# Altium schematic sheet WC_Boot.SchDoc
size B; Organization: Altium Limited; Address1: L3, 12a Rodborough Rd; Address2: Frenchs Forest; Address3: NSW; Address4: Australia 2086; DocumentNumber: 8; SheetNumber: 8; SheetTotal: 11
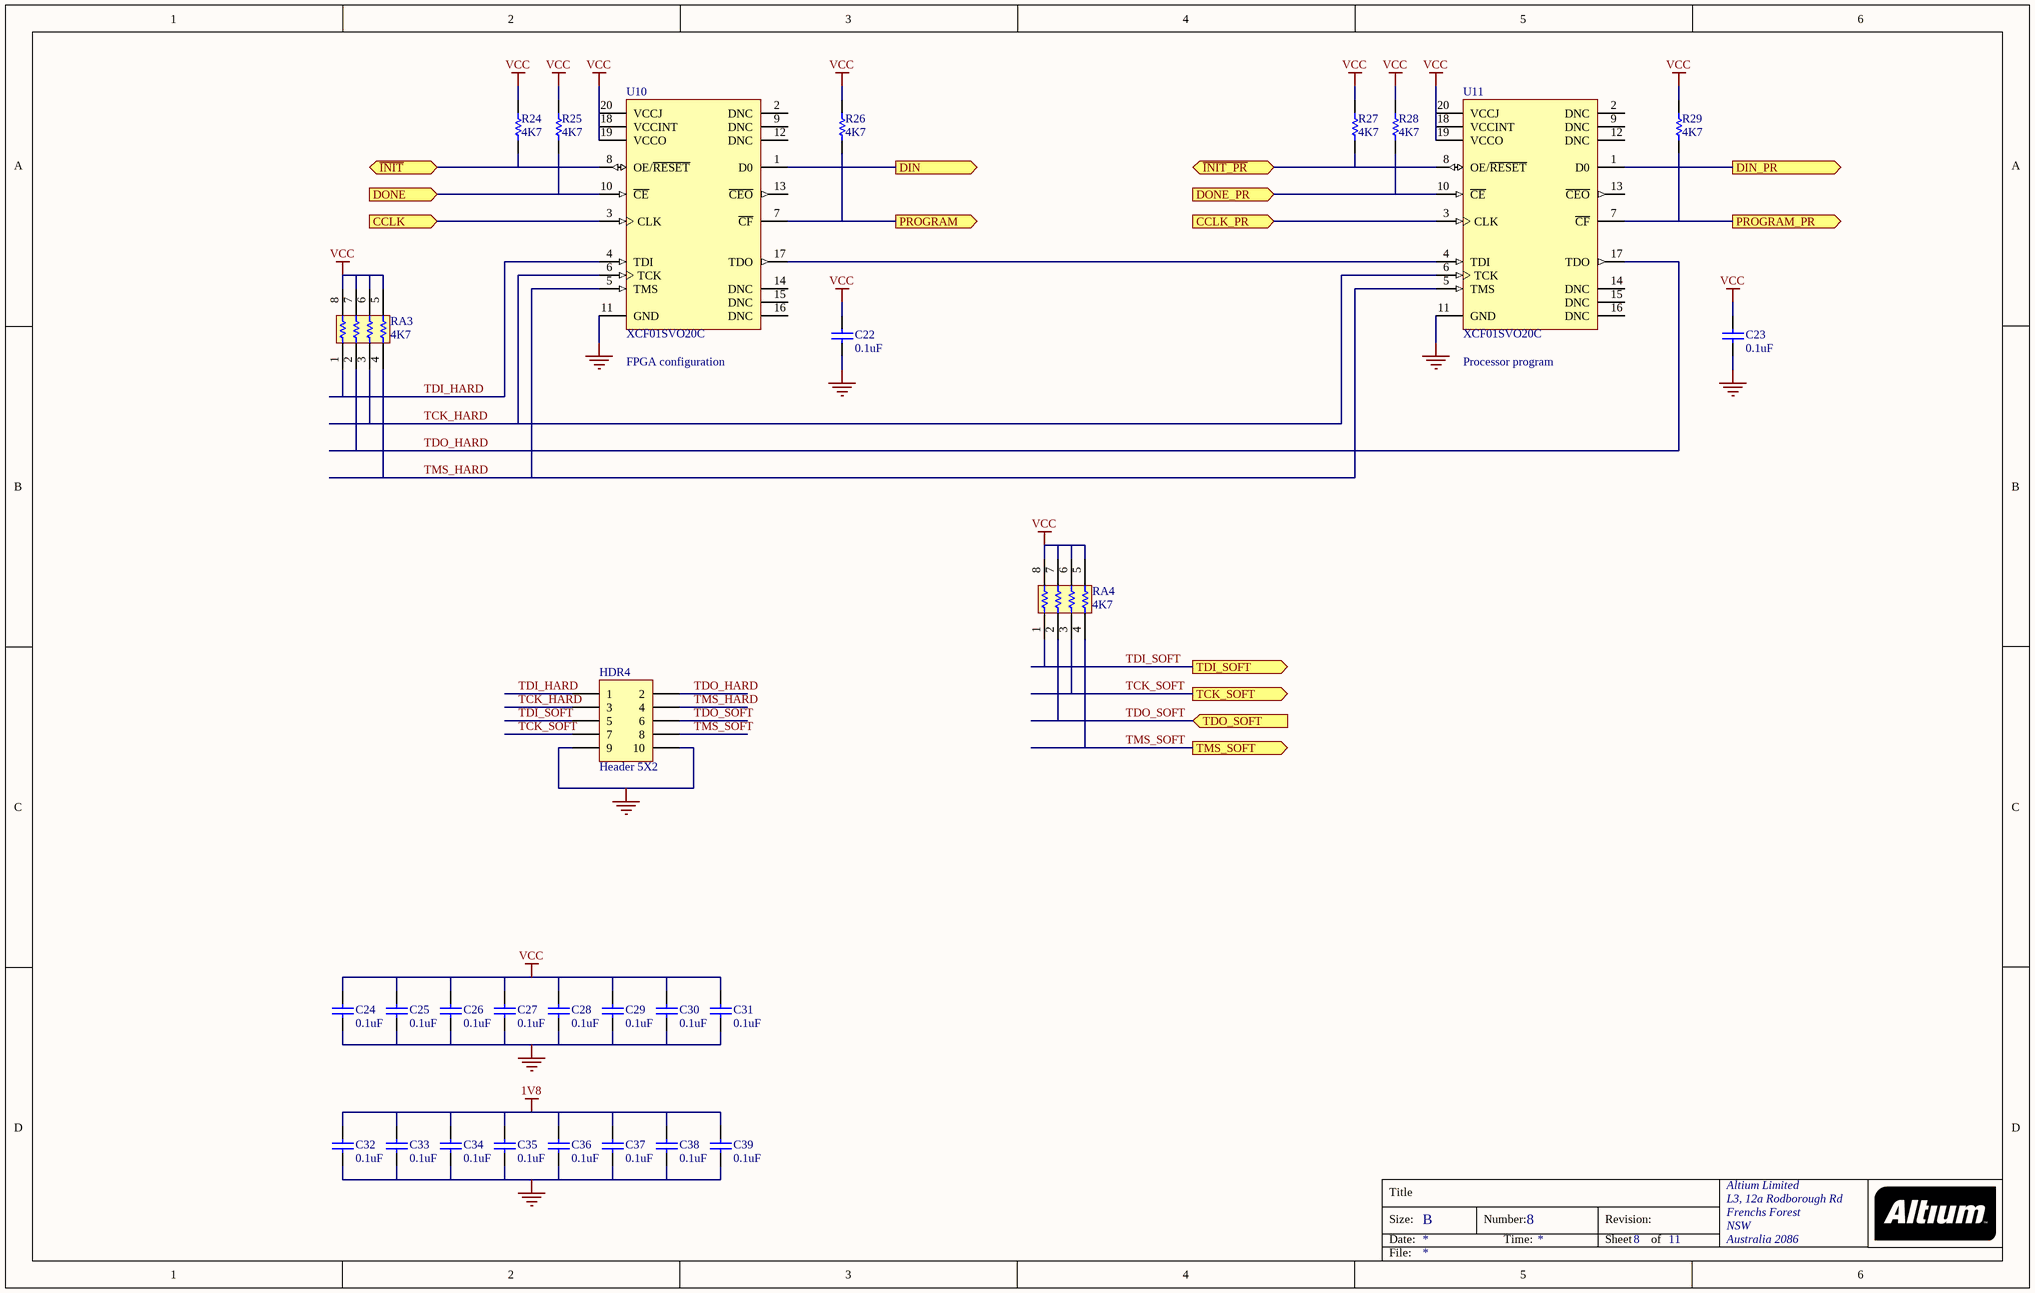
[diagram p0: WC_Boot.SchDoc]

## Parts
C22  0.1uF  [CC2012-0805]
C23  0.1uF  [CC2012-0805]
C24  0.1uF  [CC2012-0805]
C25  0.1uF  [CC2012-0805]
C26  0.1uF  [CC2012-0805]
C27  0.1uF  [CC2012-0805]
C28  0.1uF  [CC2012-0805]
C29  0.1uF  [CC2012-0805]
C30  0.1uF  [CC2012-0805]
C31  0.1uF  [CC2012-0805]
C32  0.1uF  [CC2012-0805]
C33  0.1uF  [CC2012-0805]
C34  0.1uF  [CC2012-0805]
C35  0.1uF  [CC2012-0805]
C36  0.1uF  [CC2012-0805]
C37  0.1uF  [CC2012-0805]
C38  0.1uF  [CC2012-0805]
C39  0.1uF  [CC2012-0805]
HDR4  Header 5X2  [HDR2X5]
R24  4K7  [CC2012-0805]
R25  4K7  [CC2012-0805]
R26  4K7  [CC2012-0805]
R27  4K7  [CC2012-0805]
R28  4K7  [CC2012-0805]
R29  4K7  [CC2012-0805]
RA3  4K7  [MNR34]
RA4  4K7  [MNR34]
U10  XCF01SVO20C  usage: FPGA configuration  [VO20]
U11  XCF01SVO20C  usage: Processor program  [VO20]

## Ports
CCLK (in), CCLK_PR (in), DIN (out), DIN_PR (out), DONE (in), DONE_PR (in), PROGRAM (out), PROGRAM_PR (out), TCK_SOFT (out), TDI_SOFT (out), TDO_SOFT (in), TMS_SOFT (out), ~{INIT_PR} (bidir), ~{INIT} (bidir)

## Nets
1V8: C32.1 C33.1 C34.1 C35.1 C36.1 C37.1 C38.1 C39.1
GND: C22.1 C23.1 C24.2 C25.2 C26.2 C27.2 C28.2 C29.2 C30.2 C31.2 C32.2 C33.2 C34.2 C35.2 C36.2 C37.2 C38.2 C39.2 HDR4.9 HDR4.10 U10.11(GND) U11.11(GND)
VCC: C22.2 C23.2 C24.1 C25.1 C26.1 C27.1 C28.1 C29.1 C30.1 C31.1 R24.1 R25.1 R26.1 R27.1 R28.1 R29.1 RA3.5 RA3.6 RA3.7 RA3.8 RA4.5 RA4.6 RA4.7 RA4.8 U10.18(VCCINT) U10.19(VCCO) U10.20(VCCJ) U11.18(VCCINT) U11.19(VCCO) U11.20(VCCJ)
CCLK: U10.3(CLK) ; port CCLK
CCLK_PR: U11.3(CLK) ; port CCLK_PR
DIN: U10.1(D0) ; port DIN
DIN_PR: U11.1(D0) ; port DIN_PR
DONE: R25.2 U10.10(~{CE}) ; port DONE
DONE_PR: R28.2 U11.10(~{CE}) ; port DONE_PR
~{INIT}: R24.2 U10.8(OE/~{RESET}) ; port ~{INIT}
~{INIT_PR}: R27.2 U11.8(OE/~{RESET}) ; port ~{INIT_PR}
PROGRAM: R26.2 U10.7(~{CF}) ; port PROGRAM
PROGRAM_PR: R29.2 U11.7(~{CF}) ; port PROGRAM_PR
TCK_HARD: HDR4.3 RA3.3 U10.6(TCK) U11.6(TCK)
TCK_SOFT: HDR4.7 RA4.3 ; port TCK_SOFT
TDI_HARD: HDR4.1 RA3.1 U10.4(TDI)
TDI_SOFT: HDR4.5 RA4.1 ; port TDI_SOFT
TDO_HARD: HDR4.2 RA3.2 U11.17(TDO)
TDO_SOFT: HDR4.6 RA4.2 ; port TDO_SOFT
TMS_HARD: HDR4.4 RA3.4 U10.5(TMS) U11.5(TMS)
TMS_SOFT: HDR4.8 RA4.4 ; port TMS_SOFT
NetU10_17: U10.17(TDO) U11.4(TDI)

Not connected (* = marked no-connect by the designer): U10 2(DNC) 9(DNC) 12(DNC) 13(~{CEO}) 14(DNC) 15(DNC) 16(DNC); U11 2(DNC) 9(DNC) 12(DNC) 13(~{CEO}) 14(DNC) 15(DNC) 16(DNC)

## Notes on the sheet
- Title
- Size:
- Date:
- B
- Number:
- Time:
- Revision:
- Sheet
- of
- File:

## Library data of the parts
C22-C39 = CAP: Capacitor
HDR4 = Header 5X2: Header, 5-Pin, Dual row; Manufacturer: Generic Components; Class I: Connector; Revision: July-2002: Re-released for DXP Platform.; Publisher: Altium Limited
R24-R29 = RES: Resistor
RA3 RA4 = MNR34: 3216x4 Resistor Array
U10 U11 = XCF01SVO20C: XCF00S Series, Platform Flash In-System Programmable Configuration 3.3V PROM, 1-Megabit, Commercial Grade; Manufacturer: Xilinx; Package Information: Latest Revision: ver1.0, May-2003; Class I: Memory; Code - JEDEC: MO-153-AC; Published: 20-Aug-2003; Datasheet: Latest Revision: ver1.1, June-2003; Package Reference: VO20; Publisher: Altium Limited; Class II: PROM